# EAGLE design LB_BIT_i16_PULSE-v02(rev1) (EAGLE 6.2)
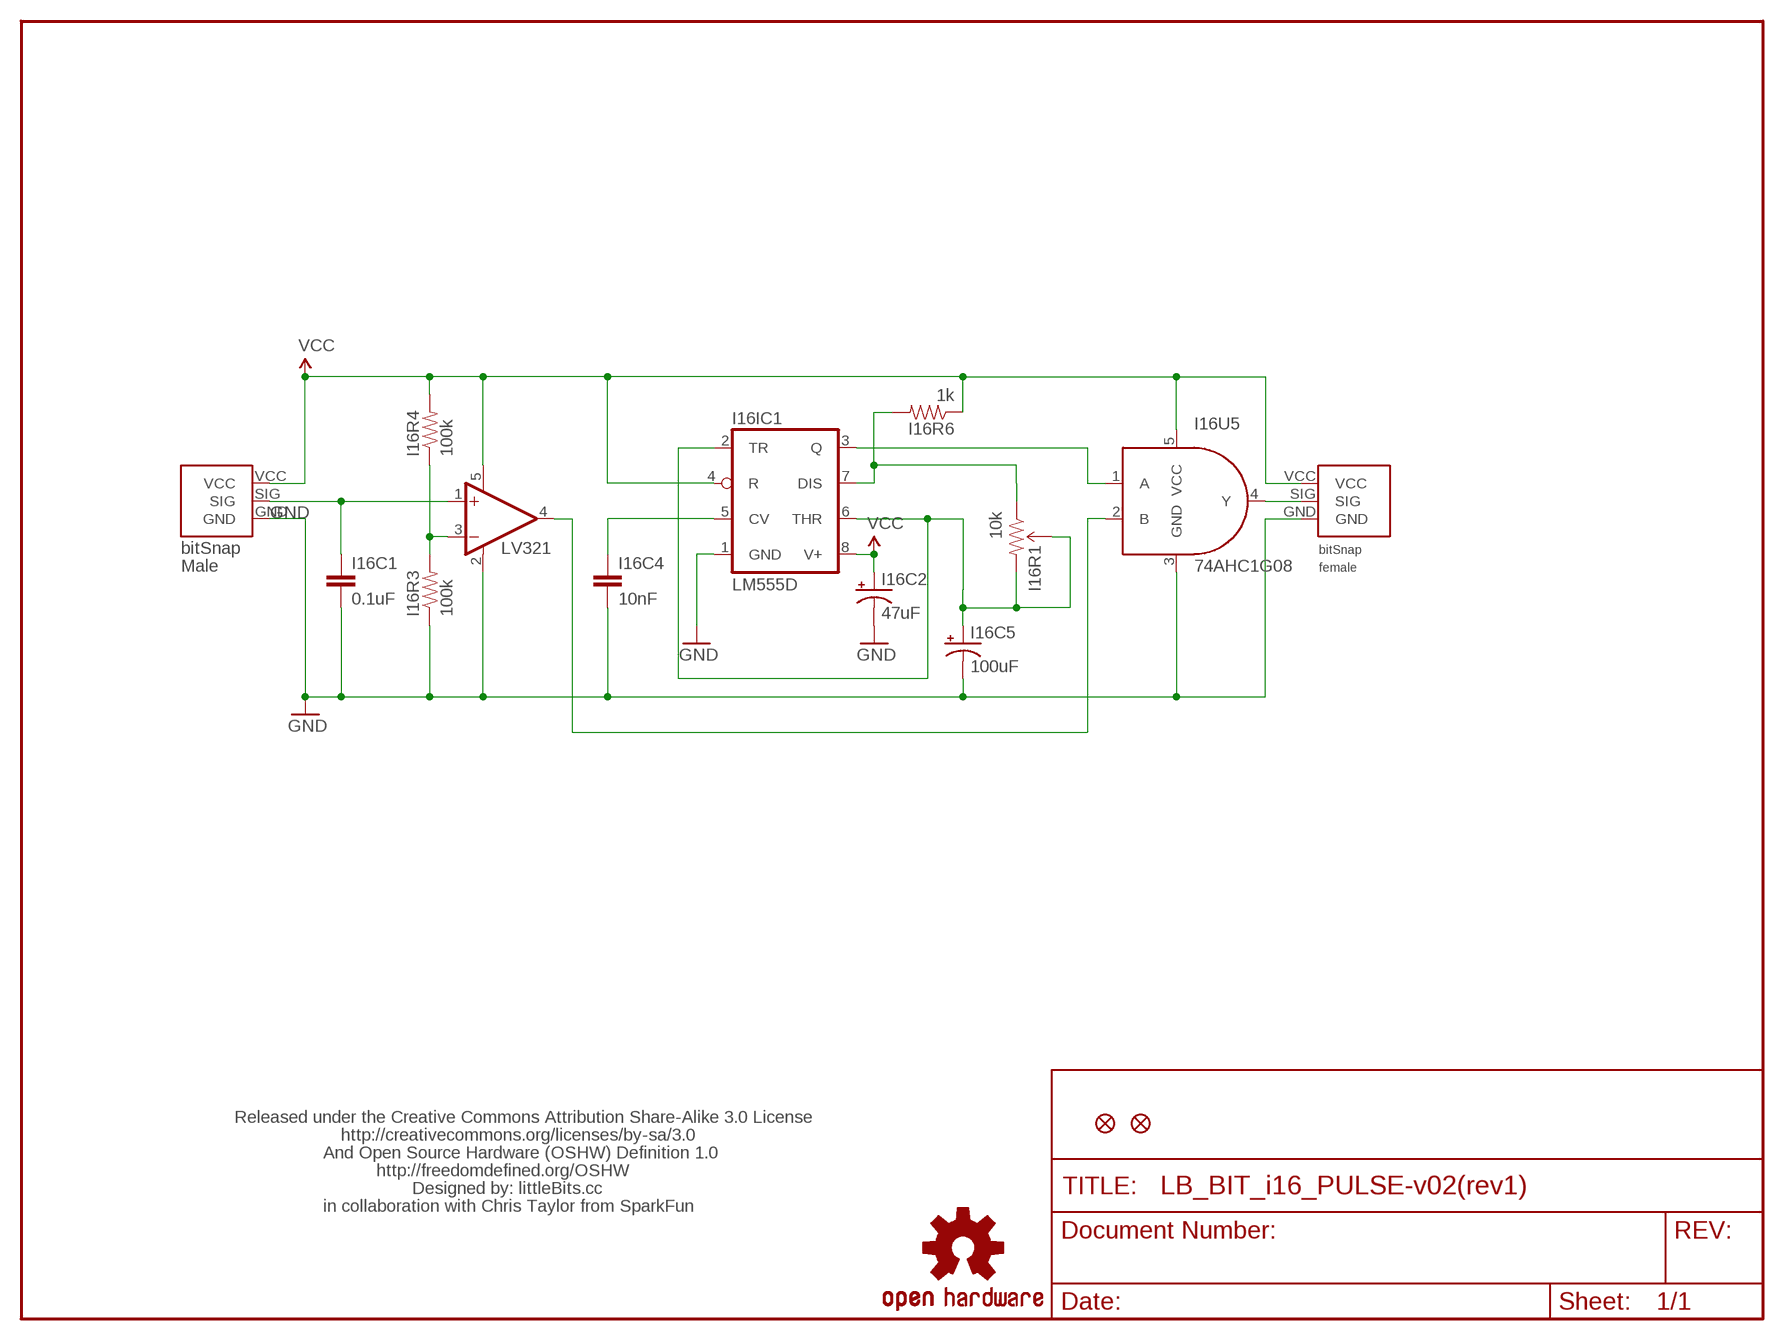
[diagram p0: schematic, sheet 1]

## Parts
I16BSF  BITSNAP_FEMALE  [BITSNAP_FEMALE]
I16BSM  BITSNAP_MALE  [BITSNAP_MALE]
I16C1  0.1uF  CAP0603-CAP  [0603-CAP]
I16C2  47uF  CAP_POL3528  [EIA3528]
I16C4  10nF  CAP0603-CAP  [0603-CAP]
I16C5  100uF  CAP_POLC  [PANASONIC_C]
I16IC1  LM555D  [SO08]
I16R1  10k  TRIMPOTSMD  [TRIMPOT-3MM]
I16R3  100k  RESISTOR0603-RES  [0603-RES]
I16R4  100k  RESISTOR0603-RES  [0603-RES]
I16R6  1k  RESISTOR0603-RES  [0603-RES]
I16U1  LV321  [SC70]
I16U5  74AHC1G08  [SOT23-5]
JP1  FIDUCIAL1X2.5  [FIDUCIAL-1X2.5]
JP2  FIDUCIAL1X2.5  [FIDUCIAL-1X2.5]
U$1  LB_CREDITS  [OSHWCREDIT]
U$5  OSHW-LOGOL  [OSHW-LOGO-L]

## Nets
GND: I16BSF.GND I16BSM.GND I16C1.2 I16C2.C(-) I16C4.2 I16C5.- I16IC1.1(GND) I16R3.1 I16U1.2(V-) I16U5.3(GND)
N$1: I16IC1.3(Q) I16U5.1(A)
N$3: I16R3.2 I16R4.1 I16U1.3(-IN)
N$6: I16U1.4(OUT) I16U5.2(B)
N$7: I16C4.1 I16IC1.5(CV)
N$8: I16IC1.7(DIS) I16R1.1(CCW) I16R6.2
N$9: I16C5.+ I16IC1.2(TR) I16IC1.6(THR) I16R1.2(WIPER) I16R1.3(CW)
PUL: I16BSF.SIG I16U5.4(Y)
SIG: I16BSM.SIG I16C1.1 I16U1.1(+IN)
VCC: I16BSF.VCC I16BSM.VCC I16C2.A(+) I16IC1.4(R) I16IC1.8(V+) I16R4.2 I16R6.1 I16U1.5(V+) I16U5.5(VCC)

## Library data of the parts
I16BSF = bitSnap:BITSNAP_FEMALE
I16BSM = bitSnap:BITSNAP_MALE
I16C1 I16C4 = SparkFun:CAP: Capacitor Standard 0603 ceramic capacitor, and 0.1" leaded capacitor.
I16C2 I16C5 = SparkFun:CAP_POL: Capacitor Polarized These are standard SMD and PTH capacitors. Normally 10uF, 47uF, and 100uF in electrolytic and tantalum varieties. Always verify the external diameter of the through hole cap, it varies with capacity, voltage, and manufacturer. The EIA devices should be standard.
I16IC1 = linear:*555: TIMER
I16R1 = SparkFun:TRIMPOT
I16R3 I16R4 I16R6 = SparkFun:RESISTOR: Resistor Basic schematic elements and footprints for 0603, 1206, and PTH 1/10th watt (small) resistors.
I16U1 = LITTLEBITS:LV321
I16U5 = SparkFun:74AHC1G08
JP1 JP2 = abes:FIDUCIAL: Fiducial Alignment Points Various fiducial points for machine vision alignment.
U$1 = LITTLEBITS:LB_CREDITS
U$5 = SparkFun:OSHW-LOGO: Open Source Hardware Logo This logo indicates the piece of hardware it is found on incorporates a OSHW license and/or adheres to the definition of open source hardware found here: http://freedomdefined.org/OSHW

## Board
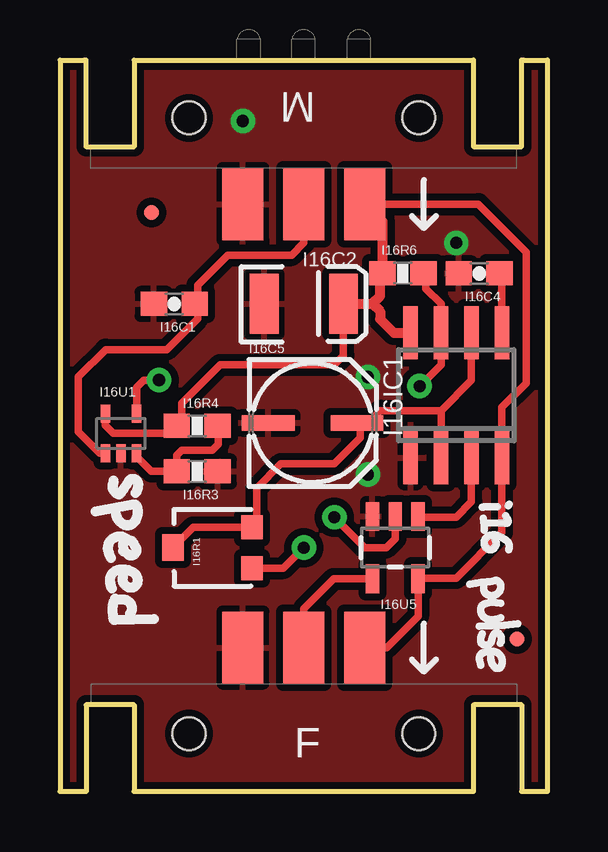
[diagram p1: board, top side]
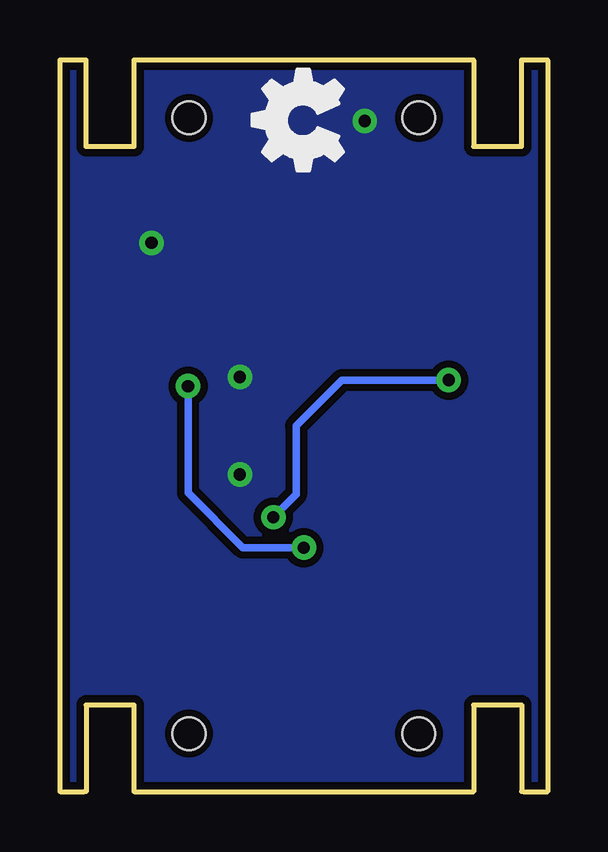
[diagram p2: board, bottom side, seen from below]

Size 20.32 x 30.48 mm. Coordinates in mm from the lower left corner, seen from the top.
Outline: 1.02,30.48 0,30.48 0,0 1.02,0
Outline: 19.3,30.48 20.32,30.48 20.32,0 19.3,0
Copper layers (1*16): Top 0.035mm / dielectric 1.5mm / Bottom 0.035mm
Design rules: minimum track width 8mil, minimum drill 20mil, track to track 8mil, track to pad 8mil, pad to pad 8mil, via to via 8mil, smd to smd 8mil, copper to edge 8mil, drill to drill 8mil, minimum pad ring 12mil, minimum via ring 10mil, stop-mask expansion 4mil, vias tented up to drill 20mil, thermal gap 10mil

### Footprints (pad centres in the part's own frame; a part is rotated, then mirrored left to right if it is on the bottom)
BITSNAP_FEMALE = smd 1.7 x 3: GND 6.35,6; SIG 8.89,6; VCC 11.43,6 | hole 1.37: 13.68,2.41; 4.1,2.41
BITSNAP_MALE = smd 1.7 x 3: GND 11.43,6; SIG 8.89,6; VCC 6.35,6 | hole 1.37: 13.68,2.41; 4.1,2.41
0603-CAP = smd 1.1 x 1: 1 -0.85,0; 2 0.85,0
EIA3528 = smd 1.2 x 2.5: A 1.65,0; C -1.65,0
PANASONIC_C = smd 2.2 x 0.65: + 1.9,-0.2; - -1.8,-0.2
SO08 = smd 0.6 x 2.2: 1 -1.905,-2.6; 2 -0.635,-2.6; 3 0.635,-2.6; 4 1.905,-2.6; 5 1.905,2.6; 6 0.635,2.6; 7 -0.635,2.6; 8 -1.905,2.6
TRIMPOT-3MM = smd 1 x 0.9: 1 -0.85,-1.65; 3 0.85,-1.65 | smd 1.1 x 0.9: 2 0,1.65
0603-RES = smd 1.1 x 1: 1 -0.85,0; 2 0.85,0
SC70 = smd 0.4 x 0.75: 1 -0.65,-0.825; 2 0,-0.825; 3 0.65,-0.825; 4 0.65,0.825; 5 -0.65,0.825
SOT23-5 = smd 0.55 x 1.2: 1 -0.95,-1.3; 2 0,-1.3; 3 0.95,-1.3; 4 0.95,1.3; 5 -0.95,1.3
FIDUCIAL-1X2.5 = smd 0.635 x 0.635: 1 0,0

### Placement (x,y rotation side)
I16BSF  1.27,0 0 top
I16BSM  19.05,30.48 180 top
I16C1  4.76,20.32 180 top
I16C2  10.16,20.32 0 top
I16C4  17.46,21.59 180 top
I16C5  10.48,15.56 0 top
I16IC1  16.51,16.51 0 top
I16R1  6.35,10.16 90 top
I16R3  5.71,13.34 180 top
I16R4  5.71,15.24 180 top
I16R6  14.29,21.59 0 top
I16U1  2.54,14.92 0 top
I16U5  13.97,10.16 180 top
JP1  19.05,6.35 0 top
JP2  3.81,24.13 0 top
U$1  7.62,-17.78 0 top  (outside the outline)
U$4  [OSHW_FILLX150_NOTEXT]  8.51,25.02 0 top
U$5  -15.24,-8.89 0 top  (outside the outline)

### Tracks (layer width: path | path; a pad name or v marks a point on that pad's centre or on a via)
GND  (via drill 0.51)
  other vias: 7.62,27.94 12.83,13.21 16.51,22.86 12.83,17.27
  pour Bottom (isolate 0.305): 0,30.48 0,0 20.32,0 20.32,30.48
  pour Top (isolate 0.305): 0,30.48 0,0 20.32,0 20.32,30.48
N$1
  Top 0.305: I16IC1.3 17.14,12.06 16.51,11.43 14.95,11.43 I16U5.1
N$3
  Top 0.305: I16R4.1 6.6,15.2 6.6,14.48 6.35,14.22 5.08,14.22 4.87,14.01 I16R3.2 3.81,13.34 3.19,13.96 I16U1.3
N$6  (via drill 0.51)
  Top 0.305: v11.43,11.43 12.7,10.16 13.59,10.16 13.97,10.54 I16U5.2 | I16U1.4 3.19,16.84 3.49,17.14 v4.13,17.14
  Bottom 0.305: v4.13,17.14 8.57,17.14 10.48,15.24 10.48,12.38 v11.43,11.43
N$7
  Top 0.305: I16IC1.5 18.41,21.57
  Top 0.61: 18.41,21.57 I16C4.1
N$8  (via drill 0.51)
  Top 0.305: 15.24,21.57 15.24,20.95 15.88,20.32 I16IC1.7 15.88,17.78 v14.99,16.89 | I16R1.1 9.31,9.31 v10.16,10.16
  Top 0.61: 15.24,21.57 I16R6.2
  Bottom 0.305: v10.16,10.16 12.7,10.16 14.99,12.45 v14.99,16.89
N$9
  Top 0.305: I16R1.3 8.15,11.01 | I16R1.3 5.55,11.01 I16R1.2 | 15.88,15.88 I16IC1.2 | I16IC1.6 17.14,17.14 15.88,15.88 | 15.88,15.88 13.34,15.88 12.7,15.24 I16C5.+ 12.51,15.05 12.51,14.73 11.43,13.65 9.21,13.65 8.19,12.64 8.19,11.2 I16R1.3
PUL
  Top 0.305: I16U5.4 11.4,8.86 10.16,7.62 I16BSF.SIG
SIG
  Top 0.305: I16BSM.SIG 10.16,22.86 9.65,22.35 6.99,22.35 5.73,21.1 5.73,20.44 I16C1.1 5.73,20.2 5.73,19.7 4.45,18.41 1.91,18.41 0.76,17.27 0.76,14.99 1.65,14.1 I16U1.1
VCC
  Top 0.305: I16R4.2 5.08,15.24 | I16BSF.VCC 13.62,6 14.92,7.3 I16U5.5 14.95,8.89 16.51,8.89 18.41,10.79 I16IC1.4 18.41,16 19.43,17.02 19.43,22.48 17.43,24.48 I16BSM.VCC | I16C2.A 11.81,18.16 11.43,17.78 6.67,17.78 5.07,16.18 5.07,15.44 I16R4.2 | I16U1.5 1.89,15.26 2.22,14.92 4.55,14.92 I16R4.2
  Top 0.406: I16C2.A 13.02,20.32 | 13.02,20.32 13.34,20.64 13.34,21.49 I16R6.1 13.44,23.74 I16BSM.VCC | I16IC1.8 13.91,19.11 13.34,19.68 13.34,20 13.02,20.32